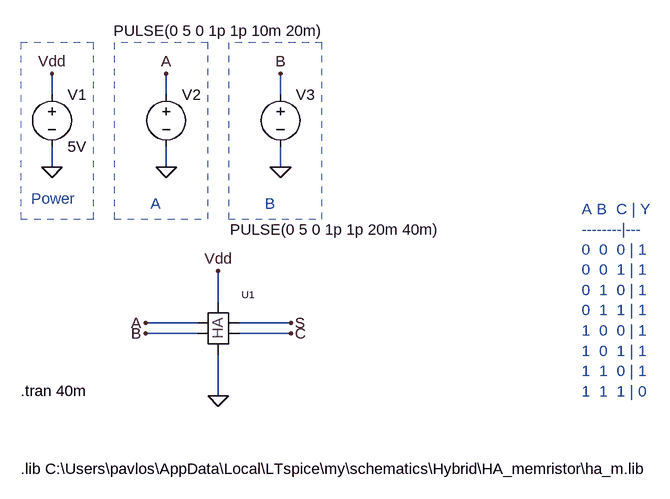
[diagram p0: schematic half_adder_block.asc]
half_adder_block.asc, the LTspice schematic file:
Version 4
SHEET 1 880 680
WIRE -560 -416 -560 -448
WIRE -384 -416 -384 -448
WIRE -208 -416 -208 -448
WIRE -560 -304 -560 -336
WIRE -384 -304 -384 -336
WIRE -208 -304 -208 -336
WIRE -304 -96 -304 -144
WIRE -336 -64 -416 -64
WIRE -192 -64 -272 -64
WIRE -336 -48 -416 -48
WIRE -192 -48 -272 -48
WIRE -304 48 -304 -16
FLAG -192 -64 S
FLAG -416 -64 A
FLAG -304 -144 Vdd
FLAG -304 48 0
FLAG -560 -304 0
FLAG -560 -448 Vdd
FLAG -384 -304 0
FLAG -384 -448 A
FLAG -192 -48 C
FLAG -208 -304 0
FLAG -208 -448 B
FLAG -416 -48 B
SYMBOL voltage -560 -432 R0
WINDOW 123 0 0 Left 0
WINDOW 39 0 0 Left 0
SYMATTR InstName V1
SYMATTR Value 5V
SYMBOL voltage -384 -432 R0
WINDOW 123 0 0 Left 0
WINDOW 39 0 0 Left 0
WINDOW 3 -81 -82 Left 2
SYMATTR InstName V2
SYMATTR Value PULSE(0 5 0 1p 1p 10m 20m)
SYMBOL voltage -208 -432 R0
WINDOW 123 0 0 Left 0
WINDOW 39 0 0 Left 0
WINDOW 3 -78 224 Left 2
SYMATTR InstName V3
SYMATTR Value PULSE(0 5 0 1p 1p 20m 40m)
SYMBOL ha_m -320 0 R0
SYMATTR InstName U1
TEXT -592 -256 Left 2 ;Power
TEXT -408 -248 Left 2 ;A
TEXT -608 40 Left 2 !.tran 40m
TEXT -608 160 Left 2 !.lib C:\\Users\\pavlos\\AppData\\Local\\LTspice\\my\\schematics\\Hybrid\\HA_memristor\\ha_m.lib
TEXT -232 -248 Left 2 ;B
TEXT 256 -240 Left 2 ;A B  C | Y\n--------|---\n0  0  0 | 1\n0  0  1 | 1\n0  1  0 | 1\n0  1  1 | 1\n1  0  0 | 1\n1  0  1 | 1\n1  1  0 | 1\n1  1  1 | 0
RECTANGLE Normal -496 -496 -608 -224 2
RECTANGLE Normal -320 -496 -464 -224 2
RECTANGLE Normal -144 -496 -288 -224 2

The netlist it stands for:
* half_adder_block.asc
V1 Vdd 0 5V
V2 A 0 PULSE(0 5 0 1p 1p 10m 20m)
V3 B 0 PULSE(0 5 0 1p 1p 20m 40m)
XU1 A B S C 0 Vdd ha_m  ; pins x y S C Vdd Vss
* Power
* A
.tran 40m
.lib C:\Users\pavlos\AppData\Local\LTspice\my\schematics\Hybrid\HA_memristor\ha_m.lib
* B
* A B  C | Y
* --------|---
* 0  0  0 | 1
* 0  0  1 | 1
* 0  1  0 | 1
* 0  1  1 | 1
* 1  0  0 | 1
* 1  0  1 | 1
* 1  1  0 | 1
* 1  1  1 | 0
.backanno
.end